# Altium schematic sheet ESP32 DEV.SchDoc
size A; SheetNumber: 13; SheetTotal: 14
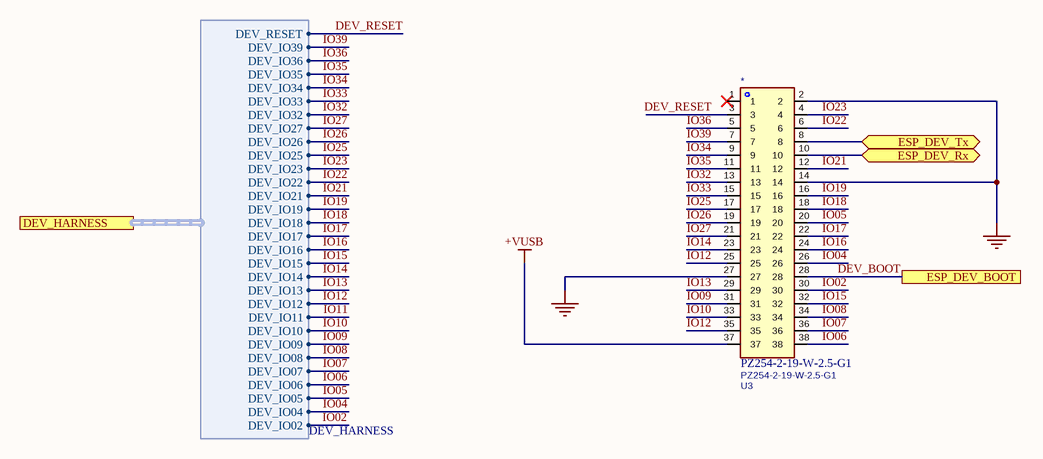
[diagram p0: ESP32 DEV.SchDoc]

## Parts
*  PZ254-2-19-W-2.5-G1  Reference: U3  [HDR-TH_38P-P2.54-H-M-R2-C19-S2.54]

## Ports
DEV_HARNESS (harness DEV_HARNESS), ESP_DEV_BOOT, ESP_DEV_Rx (bidir), ESP_DEV_Tx (bidir)

## Harnesses
DEV_HARNESS: DEV_IO02, DEV_IO04, DEV_IO05, DEV_IO06, DEV_IO07, DEV_IO08, DEV_IO09, DEV_IO10, DEV_IO11, DEV_IO12, DEV_IO13, DEV_IO14, DEV_IO15, DEV_IO16, DEV_IO17, DEV_IO18, DEV_IO19, DEV_IO21, DEV_IO22, DEV_IO23, DEV_IO25, DEV_IO26, DEV_IO27, DEV_IO32, DEV_IO33, DEV_IO34, DEV_IO35, DEV_IO36, DEV_IO39, DEV_RESET

## Nets
+VUSB: *.37
GND: *.2 *.14 *.27
DEV_BOOT: *.28 ; port ESP_DEV_BOOT
DEV_RESET: *.3 ; port DEV_HARNESS.DEV_RESET
ESP_DEV_Rx: *.10 ; port ESP_DEV_Rx
ESP_DEV_Tx: *.8 ; port ESP_DEV_Tx
IO02: *.30 ; port DEV_HARNESS.DEV_IO02
IO04: *.26 ; port DEV_HARNESS.DEV_IO04
IO05: *.20 ; port DEV_HARNESS.DEV_IO05
IO06: *.38 ; port DEV_HARNESS.DEV_IO06
IO07: *.36 ; port DEV_HARNESS.DEV_IO07
IO08: *.34 ; port DEV_HARNESS.DEV_IO08
IO09: *.31 ; port DEV_HARNESS.DEV_IO09
IO10: *.33 ; port DEV_HARNESS.DEV_IO10
IO11: port DEV_HARNESS.DEV_IO11
IO12: *.25 *.35 ; port DEV_HARNESS.DEV_IO12
IO13: *.29 ; port DEV_HARNESS.DEV_IO13
IO14: *.23 ; port DEV_HARNESS.DEV_IO14
IO15: *.32 ; port DEV_HARNESS.DEV_IO15
IO16: *.24 ; port DEV_HARNESS.DEV_IO16
IO17: *.22 ; port DEV_HARNESS.DEV_IO17
IO18: *.18 ; port DEV_HARNESS.DEV_IO18
IO19: *.16 ; port DEV_HARNESS.DEV_IO19
IO21: *.12 ; port DEV_HARNESS.DEV_IO21
IO22: *.6 ; port DEV_HARNESS.DEV_IO22
IO23: *.4 ; port DEV_HARNESS.DEV_IO23
IO25: *.17 ; port DEV_HARNESS.DEV_IO25
IO26: *.19 ; port DEV_HARNESS.DEV_IO26
IO27: *.21 ; port DEV_HARNESS.DEV_IO27
IO32: *.13 ; port DEV_HARNESS.DEV_IO32
IO33: *.15 ; port DEV_HARNESS.DEV_IO33
IO34: *.9 ; port DEV_HARNESS.DEV_IO34
IO35: *.11 ; port DEV_HARNESS.DEV_IO35
IO36: *.5 ; port DEV_HARNESS.DEV_IO36
IO39: *.7 ; port DEV_HARNESS.DEV_IO39

Not connected (* = marked no-connect by the designer): * 1*

## Library data of the parts
* = PZ254-2-19-W-2.5-G1: Footprint: easyeda2kicad:HDR-TH_38P-P2.54-H-M-R2-C19-S2.54; LCSC Part: C18198033; Value: PZ254-2-19-W-2.5-G1